# Altium schematic sheet CM6206_PINOUT.SchDoc
size C; SheetNumber: 2; SheetTotal: 20
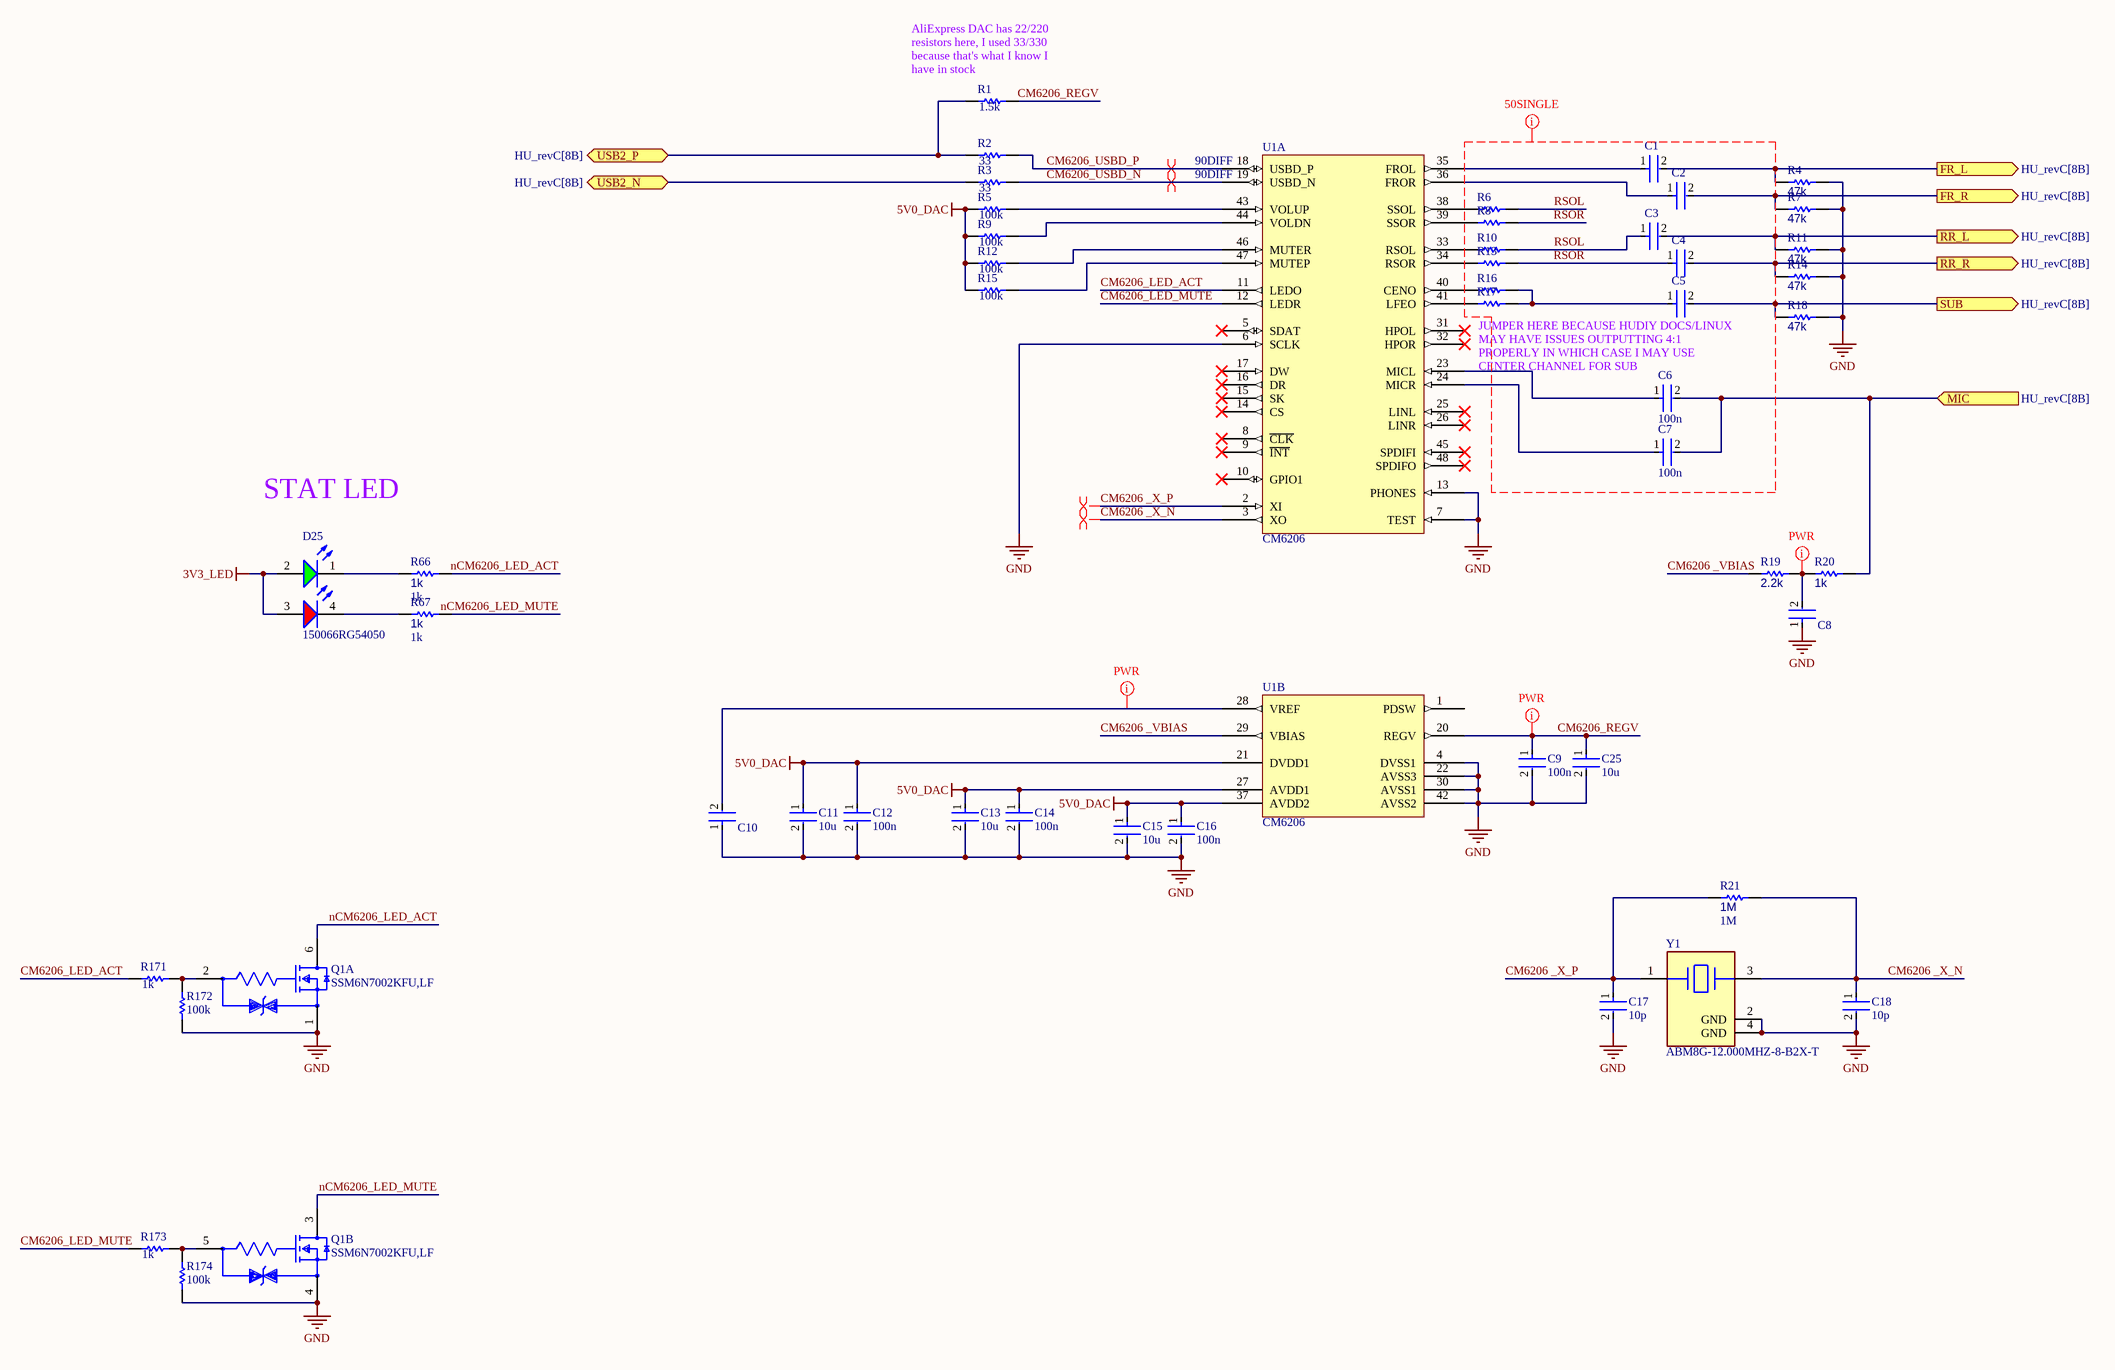
[diagram p0: CM6206_PINOUT.SchDoc]

## Parts
C1  EMK107BBJ106MA-T  [FP-0603-L_1_6_0_2-W_0_8_0-MFG]  (value not drawn)
C2  EMK107BBJ106MA-T  [FP-0603-L_1_6_0_2-W_0_8_0-MFG]  (value not drawn)
C3  EMK107BBJ106MA-T  [FP-0603-L_1_6_0_2-W_0_8_0-MFG]  (value not drawn)
C4  EMK107BBJ106MA-T  [FP-0603-L_1_6_0_2-W_0_8_0-MFG]  (value not drawn)
C5  EMK107BBJ106MA-T  [FP-0603-L_1_6_0_2-W_0_8_0-MFG]  (value not drawn)
C6  100n  [FP-0402-L_1_0_0_05-W_0_5-IPC_A]
C7  100n  [FP-0402-L_1_0_0_05-W_0_5-IPC_A]
C8  EMK107BBJ106MA-T  [FP-0603-L_1_6_0_2-W_0_8_0-MFG]  (value not drawn)
C9  100n  [FP-0402-L_1_0_0_05-W_0_5-IPC_A]
C10  EMK107BBJ106MA-T  [FP-0603-L_1_6_0_2-W_0_8_0-MFG]  (value not drawn)
C11  10u  [FP-0402-L_1_0_0_05-W_0_5-IPC_A]
C12  100n  [FP-0402-L_1_0_0_05-W_0_5-IPC_A]
C13  10u  [FP-0402-L_1_0_0_05-W_0_5-IPC_A]
C14  100n  [FP-0402-L_1_0_0_05-W_0_5-IPC_A]
C15  10u  [FP-0402-L_1_0_0_05-W_0_5-IPC_A]
C16  100n  [FP-0402-L_1_0_0_05-W_0_5-IPC_A]
C17  10p  [FP-0402-L_1_0_0_05-W_0_5-IPC_A]
C18  10p  [FP-0402-L_1_0_0_05-W_0_5-IPC_A]
C25  10u  [FP-0402-L_1_0_0_05-W_0_5-IPC_A]
D25  150066RG54050  [WL-SBCD_0606]
Q1  SSM6N7002KFU,LF  [FP-SSOP6-P-0_65A-MFG]  (parts A,B of 2)
R1  1.5k  [R0603B]
R2  33  [R0603B]
R3  33  [R0603B]
R4  47k  [R0603B]
R5  100k  [R0603B]
R6  DNP  [RESC1005X40X25ML05T05]  (value not drawn)
R7  47k  [R0603B]
R8  DNP  [RESC1005X40X25ML05T05]  (value not drawn)
R9  100k  [R0603B]
R10  0402 JUMPER  [RESC1005X40X25ML05T05]  (value not drawn)
R11  47k  [R0603B]
R12  100k  [R0603B]
R13  0402 JUMPER  [RESC1005X40X25ML05T05]  (value not drawn)
R14  47k  [R0603B]
R15  100k  [R0603B]
R16  DNP  [RESC1005X40X25ML05T05]  (value not drawn)
R17  0402 JUMPER  [RESC1005X40X25ML05T05]  (value not drawn)
R18  47k  [R0603B]
R19  2.2k  [R0603B]
R20  1k  [R0603B]
R21  1M  [R0603B]
R66  1k  [R0603B]
R67  1k  [R0603B]
R171  1k  [R0603B]
R172  100k  [R0603B]
R173  1k  [R0603B]
R174  100k  [R0603B]
U1  CM6206  [CQFP50P900X900X160-48N]  (parts A,B of 2)
Y1  ABM8G-12.000MHZ-8-B2X-T  [FP-ABM8G-MFG]

## Ports
FR_L (out, see HU_revC[8B]), FR_R (out, see HU_revC[8B]), MIC (in, see HU_revC[8B]), RR_L (out, see HU_revC[8B]), RR_R (out, see HU_revC[8B]), SUB (out, see HU_revC[8B]), USB2_N (bidir, see HU_revC[8B]), USB2_P (bidir, see HU_revC[8B])

## Nets
3V3_LED: D25.2(A) D25.3(A)
5V0_DAC: C11.1 C12.1 C13.1 C14.1 C15.1 C16.1 R5.2 R9.2 R12.2 R15.2 U1.21(DVDD1) U1.27(AVDD1) U1.37(AVDD2)
GND: C8.1 C9.2 C10.1 C11.2 C12.2 C13.2 C14.2 C15.2 C16.2 C17.2 C18.2 C25.2 Q1.1(Source1) Q1.4(Source2) R4.1 R7.1 R11.1 R14.1 R18.1 R172.2 R174.2 U1.4(DVSS1) U1.6(SCLK) U1.7(TEST) U1.13(PHONES) U1.22(AVSS3) U1.30(AVSS1) U1.42(AVSS2) Y1.2(GND) Y1.4(GND)
CM6206 _VBIAS: R19.2 U1.29(VBIAS)
CM6206 _X_N: C18.1 R21.1 U1.3(XO) Y1.3
CM6206 _X_P: C17.1 R21.2 U1.2(XI) Y1.1
CM6206_LED_ACT: R171.2 U1.11(LEDO)
CM6206_LED_MUTE: R173.2 U1.12(LEDR)
CM6206_REGV: C9.1 C25.1 R1.1 U1.20(REGV)
CM6206_USBD_N: R3.1 U1.19(USBD_N)
CM6206_USBD_P: R2.1 U1.18(USBD_P)
FR_L: C1.2 R4.2 ; port FR_L
FR_R: C2.2 R7.2 ; port FR_R
MIC: C6.2 C7.2 R20.1 ; port MIC
nCM6206_LED_ACT: Q1.6(Drain1) R66.2
nCM6206_LED_MUTE: Q1.3(Drain2) R67.2
RR_L: C3.2 R11.2 ; port RR_L
RR_R: C4.2 R14.2 ; port RR_R
RSOL: C3.1 R6.2 R10.2
RSOR: C4.1 R8.2 R13.2
SUB: C5.2 R18.2 ; port SUB
USB2_N: R3.2 ; port USB2_N
USB2_P: R1.2 R2.2 ; port USB2_P
NetC1_1: C1.1 U1.35(FROL)
NetC2_1: C2.1 U1.36(FROR)
NetC5_1: C5.1 R16.2 R17.2
NetC6_1: C6.1 U1.23(MICL)
NetC7_1: C7.1 U1.24(MICR)
NetC8_2: C8.2 R19.1 R20.2
NetC10_2: C10.2 U1.28(VREF)
NetD25_1: D25.1(K) R66.1
NetD25_4: D25.4(K) R67.1
NetQ1_2: Q1.2(Gate1) R171.1 R172.1
NetQ1_5: Q1.5(Gate2) R173.1 R174.1
NetR5_1: R5.1 U1.43(VOLUP)
NetR6_1: R6.1 U1.38(SSOL)
NetR8_1: R8.1 U1.39(SSOR)
NetR9_1: R9.1 U1.44(VOLDN)
NetR10_1: R10.1 U1.33(RSOL)
NetR12_1: R12.1 U1.46(MUTER)
NetR13_1: R13.1 U1.34(RSOR)
NetR15_1: R15.1 U1.47(MUTEP)
NetR16_1: R16.1 U1.40(CENO)
NetR17_1: R17.1 U1.41(LFEO)

Not connected (* = marked no-connect by the designer): U1 1(PDSW) 5(SDAT)* 8(~{CLK})* 9(~{INT})* 10(GPIO1)* 14(CS)* 15(SK)* 16(DR)* 17(DW)* 25(LINL)* 26(LINR)* 31(HPOL)* 32(HPOR)* 45(SPDIFI)* 48(SPDIFO)*

## Layout directives
differential pair: CM6206 _X_N, CM6206 _X_P
differential pair; differential pair class 90DIFF: CM6206_USBD_N, CM6206_USBD_P
net class PWR: CM6206_REGV, NetC8_2, NetC10_2
net class 50SINGLE: RSOL, RSOR

## Notes on the sheet
- (near R1) AliExpress DAC has 22/220 resistors here, I used 33/330 because that's what I know I have in stock
- JUMPER HERE BECAUSE HUDIY DOCS/LINUX MAY HAVE ISSUES OUTPUTTING 4:1 PROPERLY IN WHICH CASE I MAY USE CENTER CHANNEL FOR SUB
- STAT LED

## Library data of the parts
C1-C5 C8 C10 = CMP-2000-06226-4: Multilayer Ceramic Capacitor 10uF 16V X5R 20% SMD 0603 T/R; Packaging: Tape and Reel; Construction: Flat; Height: 0.8mm; Max Operating Temperature: 85°C; Dielectric: X5R; Case Code (Metric): 1608; Voltage Rating (DC): 16V; Width: 0.031inch; Voltage Rating: 16V; Length: 0.063inch; RoHS Compliant: Yes; Halogen Free: Halogen Free; Case Code (Imperial): 0603; Capacitance: 10uF; Mount: Surface Mount; Thickness: 0.031inch; Tolerance: 20%; Min Operating Temperature: -55°C; Series: M; Termination: SMD/SMT; Case/Package: 0603; Package Quantity: 1
C6 C7 C9 C11-C18 C25 = CMP-001-00058-1: LARGE PADS, 0402 CAP, CHANGE COMMENT TO MATCH REAL P/N; Capacitor Type: Ceramic; Min Operating Temperature: -55°C; Mounting Technology: Surface Mount; Pins: 2; Case/Package: 0402; RoHS Compliant: Yes; Max Operating Temperature: 85°C
D25 = CMP-004-00040-2: Led, Red/Grn, 180Mcd/230Mcd, 624Nm/525Nm Rohs Compliant: Yes; Source: rgled.SchLib; Component Type: Standard; Pins: 4; Design Item ID: CMP-004-00034-2
Q1 = CMP-006-0005-1: Transistor MOSFET Array Dual N-CH 60V 300mA 6-Pin SOT-363 Emboss T/R; Max Power Dissipation: 285mW; Input Capacitance: 40pF; FET Type: 2 N-Channel; Rds On Max: 1.5R; Mounting Technology: Surface Mount; Continuous Drain Current (ID): 300mA; Drain to Source Voltage (Vdss): 60V; Packaging: Cut Tape; Series: -
R1-R3 = CMP-009-00002-14: Resistor; Value: 220
R4 R5 R7 R9 R11 R12 R14 R15 R18-R21 R66 R67 R171-R174 = CMP-009-00002-14: Resistor
  R4 R7 R11 R14 R18: Value: 47k
  R5 R9 R12 R15 R172 R174: Value: 100k
  R19: Value: 2.2k
  R20 R66 R67 R171 R173: Value: 1k
  R21: Value: 1M
R6 R8 R10 R13 R16 R17 = CMP-009-00118-2: READ THE NAME; Pins: 2; Component Type: Standard; Design Item ID: CMP-009-00206-2; Source: 0402jump.SchLib
U1 = CMP-015-00016-2: Highly Integrated USB Audio I/O Controller
Y1 = CMP-27762-015492-1: Crystal 12MHz ±20ppm (Tol) ±20ppm (Stability) 8pF FUND 120Ω 4-Pin SMD T/R